# Altium project li-ion-supply.PrjPcb
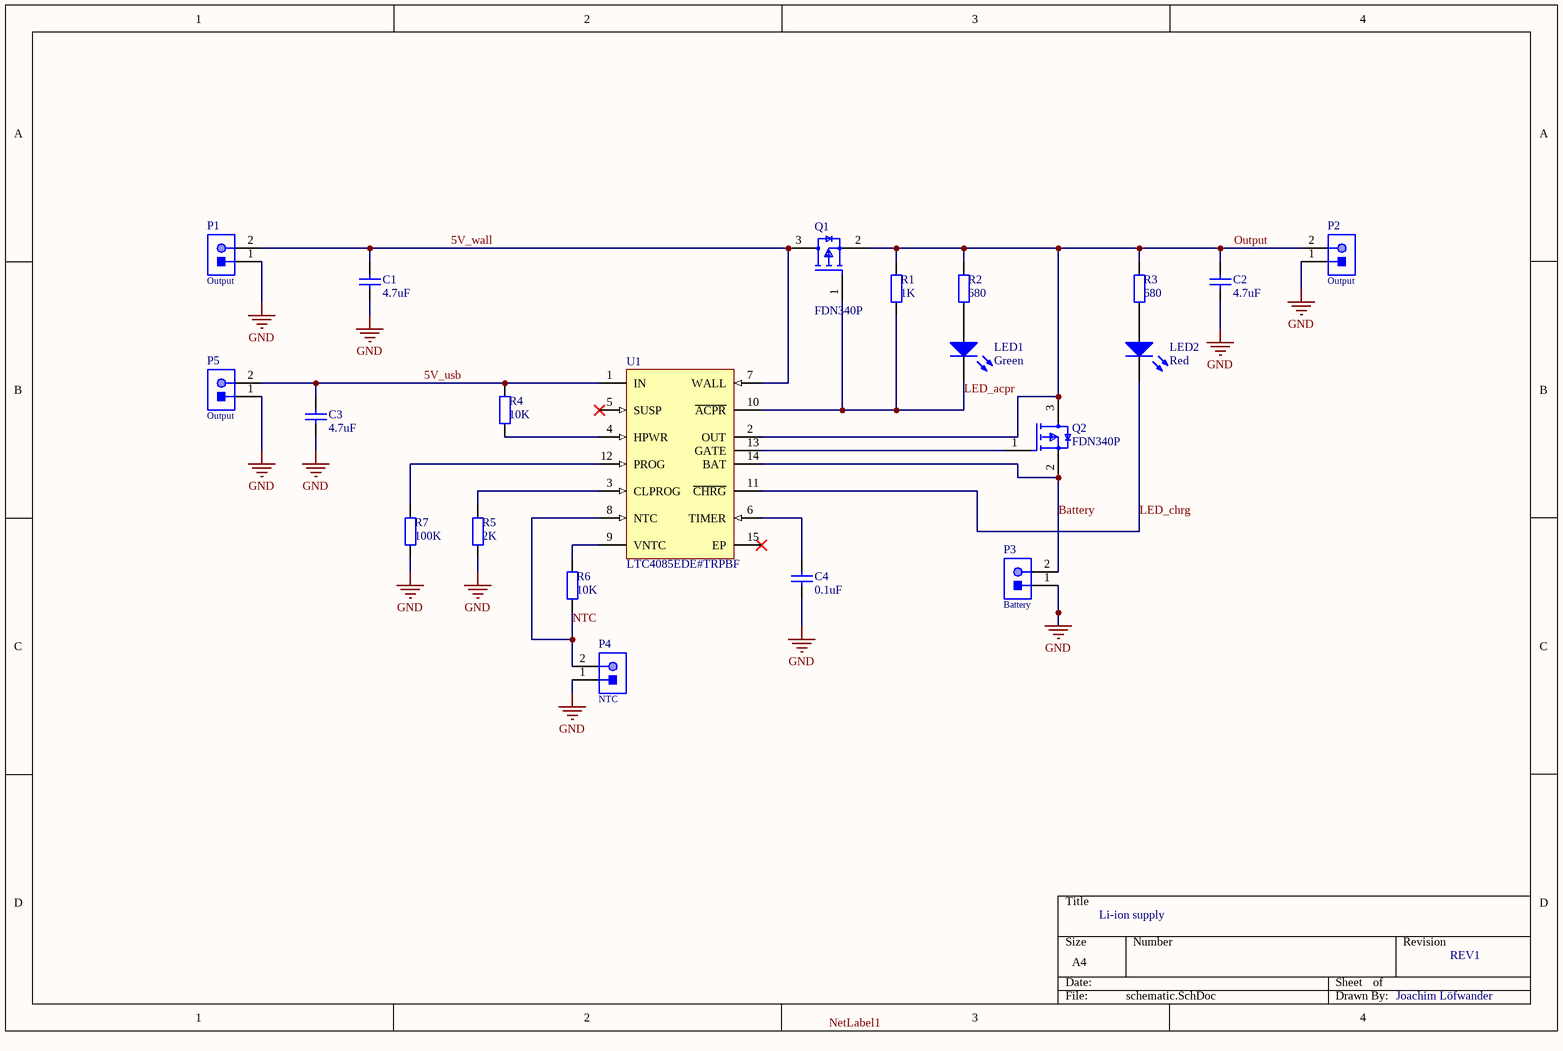
[diagram p0: schematic.SchDoc]
1 sheet, 21 parts. Net scope: global (net labels, ports and power ports of the same name join across sheets).
Board file: pcb.PcbDoc

## Sheet schematic.SchDoc: Li-ion supply
size A4; DrawnBy: Joachim Löfwander; DocumentNumber: 1; Revision: REV1; SheetNumber: 1; SheetTotal: 1

### Parts
C1  4.7uF  [CAPC2013X145X50ML20T25]
C2  4.7uF  [CAPC2013X145X50ML20T25]
C3  4.7uF  [CAPC2013X145X50ML20T25]
C4  0.1uF  [CAPC2013X135X45ML10T25]
LED1  Green  [0805_A]
LED2  Red  [0805_A]
P1  Output  [61300211121]
P2  Output  [61300211121]
P3  Battery  [61300211121]
P4  NTC  [61300211121]
P5  Output  [61300211121]
Q1  FDN340P  [FP-527AG-MFG]
Q2  FDN340P  [FP-527AG-MFG]
R1  1K  [RESC2013X50X30ML20T20]
R2  680  [RESC2013X50X30ML20T20]
R3  680  [RESC2013X50X30ML20T20]
R4  10K  [RESC2013X70X40ML20T20]
R5  2K  [RESC2013X60X35ML10T20]
R6  10K  [RESC2012X145X30ML20T15]
R7  100K  [RESC2013X70X40ML20T20]
U1  LTC4085EDE#TRPBF  [LT-DE-14_V]

### Nets
GND: C1.1 C2.1 C3.1 C4.1 P1.1 P2.1 P3.1 P4.1 P5.1 R5.1 R7.1
5V_usb: C3.2 P5.2 R4.2 U1.1(IN)
5V_wall: C1.2 P1.2 Q1.3(D) U1.7(WALL)
Battery: P3.2 Q2.2(S) U1.14(BAT)
LED_acpr: LED1.1(K) Q1.1(G) R1.1 U1.10(~{ACPR})
LED_chrg: LED2.1(K) U1.11(~{CHRG})
NTC: P4.2 R6.1 U1.8(NTC)
Output: C2.2 P2.2 Q1.2(S) Q2.3(D) R1.2 R2.2 R3.2 U1.2(OUT)
NetC4_2: C4.2 U1.6(TIMER)
NetLED1_2: LED1.2(A) R2.1
NetLED2_2: LED2.2(A) R3.1
NetQ2_1: Q2.1(G) U1.13(GATE)
NetR4_1: R4.1 U1.4(HPWR)
NetR5_2: R5.2 U1.3(CLPROG)
NetR6_2: R6.2 U1.9(VNTC)
NetR7_2: R7.2 U1.12(PROG)

Not connected (* = marked no-connect by the designer): U1 5(SUSP)* 15(EP)*

### Notes on the sheet
- Labels drawn without touching a wire or pin: NetLabel1

### Library data of the parts
C1-C3 = CMP-2007-01010-1: Manufacturer: Kemet; Part Number: C0805C475K3PACTU
C4 = CMP-2100-03644-1: Chip Capacitor, 0.1 uF, +/- 10%, 50 V, -55 to 125 degC, 0805 (2012 Metric), RoHS, Tape and Reel; Manufacturer: Murata; Voltage: 50V; Capacitance: 100nF; Insulation Resistance: 10GR; Dielectric Material: Ceramic; Dielectric: X7R; Package Description: 2-Pin Surface Mount Device, Body 2 x 1.25 mm; Manufacturer URL: http://www.murata.com/; Case Code (Imperial): 0805; Datasheet URL: http://psearch.en.murata.com/capacitor/product/GRM21BR71H104KA01%23.pdf; Termination: SMD/SMT; Lead Free: LeadFree; Package Quantity: 1; Mount: SurfaceMount; REACH SVHC: Unknown; Thickness: 0.053inch; Height: 1.25mm; Case/Package: 0805; Voltage Rating: 50V; Width: 0.049inch; Case Code (Metric): 2012; Material: Ceramic; Min Operating Temperature: -55degC; RoHSCompliant: true; Datasheet Version: 42675.0; Voltage Rating (DC): 50V; Tolerance: 10%; Package Reference: 0805; Depth: 1.25mm; Length: 2mm; Max Operating Temperature: 125degC; Packaging: TapeandReel; Number of Pins: 2; Radiation Hardening: No
LED1 = CMP-1426-00007-1: SMD mono-color Chip LED, WL-SMCW, Green; PartNumber: 150080GS75000; Manufacturer: Wuerth Elektronik; PackageReference: 0805_A; Color: Green; ComponentLink2URL: http://katalog.we-online.com/led/datasheet/150080GS75000.pdf; ComponentLink1URL: http://www.we-online.com; ComponentLink1Description: Manufacturer URL; ComponentLink2Description: Datasheet
LED2 = CMP-1426-00011-1: SMD mono-color Chip LED, WL-SMCW, Red; PartNumber: 150080RS75000; Manufacturer: Wuerth Elektronik; Color: Red; PackageReference: 0805_A; ComponentLink2Description: Datasheet; ComponentLink1URL: http://www.we-online.com; ComponentLink1Description: Manufacturer URL; ComponentLink2URL: http://katalog.we-online.com/led/datasheet/150080RS75000.pdf
P1-P5 = CMP-1712-00002-4: THT Vertical Pin Header WR-PHD, Pitch 2.54 mm, Single Row, 2 pins; Manufacturer: Wurth Elektronik; Rated Current: 3A; Gender: Male; Withstanding Voltage: 500VAC; Working Voltage: 250VAC; Pitch: 2.54mm; Contact Resistance: 20mOhm; Pin Number: 2; Mounting Technology: THT; Orientation: Vertical; Operating Temperature: -40to105degC; Packaging: Bag; Publisher: WurthElektronik; Datasheet URL: https://katalog.we-online.de/em/datasheet/6130xx11121.pdf; Manufacturer URL: http://www.we-online.de; Row Number: Single; Package Reference: 61300211121; Part Number: 61300211121
Q1 Q2 = CMP-2100-03638-2: MOSFET P-CH 20V 2A SSOT3; Fall Time: 11ns; Rise Time: 9ns; Voltage Rating (DC): -20V; Power Dissipation: 500mW; Nominal Vgs: -800mV; Current Rating: -2A; Gate to Source Voltage (Vgs): 8V; Rds On Max: 70mR; Turn-Off Delay Time: 27ns; Element Configuration: Single; Number of Elements: 1; Input Capacitance: 779pF; Drain to Source Resistance: 60mR; Turn-On Delay Time: 10ns; Package Quantity: 1; Mount: Surface Mount; Case/Package: SOT-23; Min Operating Temperature: -55°C; REACH SVHC: No SVHC; Weight: 0.03g; Packaging: Tape and Reel; Threshold Voltage: -800mV; Max Operating Temperature: 150°C; Dual Supply Voltage: -20V; Termination: SMD/SMT; Drain to Source Voltage (Vdss): 20V; Height: 0.94mm; Length: 2.92mm; Contact Plating: Tin; Width: 3.05mm; Drain to Source Breakdown Voltage: -20V; Max Power Dissipation: 500mW; Continuous Drain Current (ID): 2A; Number of Pins: 3; Lead Free: Lead Free; Radiation Hardening: No; On-State Resistance: 70MR
R1 = CMP-1013-00510-2: Part Number: CRCW08051K00FKEA; Manufacturer: Vishay Dale
R2 R3 = CMP-2001-04066-1: Manufacturer: Vishay Dale; Part Number: CRCW0805680RFKEA
R4 = CMP-2001-00337-1: Part Number: ERJ-6GEYJ103V; Manufacturer: Panasonic
R5 = CMP-2001-01361-1: Manufacturer: Yageo; Part Number: RC0805JR-072KL
R6 = CMP-2001-04354-1: Manufacturer: Vishay Dale; Part Number: NTHS0805N02N1002JE
R7 = CMP-2001-00338-1: Part Number: ERJ-6GEYJ104V; Manufacturer: Panasonic
U1 = CMP-0478-00061-1: USB Power Manager with Ideal Diode Controller and Li-Ion Charger with 4.2 V Float Voltage, 29% Vvntc, Undervoltage Current Limit, 4.35 to 5.5 V Vin, 14-pin SON (DE-14), -40 to 85 degC, Pb-Free, Tape and Reel; Manufacturer: Linear Technology; Number of Cells: 1; Vin Min(V): 4.35; Vin Max(V): 5.5; ComponentLink2URL: http://cds.linear.com/docs/en/datasheet/4085fd.pdf; ComponentLink1URL: http://www.linear.com/; DatasheetVersion: Rev. D; ComponentLink1Description: Manufacturer URL; PackageVersion: Rev. B, 06/2010; Packing: Tape and Reel; RoHS: TRUE; Mounting Technology: Surface Mount; PartNumber: LTC4085EDE#TRPBF; ComponentLink3URL: http://www.linear.com/docs/en/packaging/DFN_14_05-08-1708.pdf; PackageReference: DE-14; ComponentLink3Description: Package Specification; PackageDescription: 14-Pin Plastic DFN, Body 4 x 3 mm, Pitch 0.5 mm; Code_JEDEC: MO-229; ComponentLink2Description: Datasheet; Number of Outputs: 1